# EAGLE design Serial-Basic-CH340C (EAGLE 9.2.1)
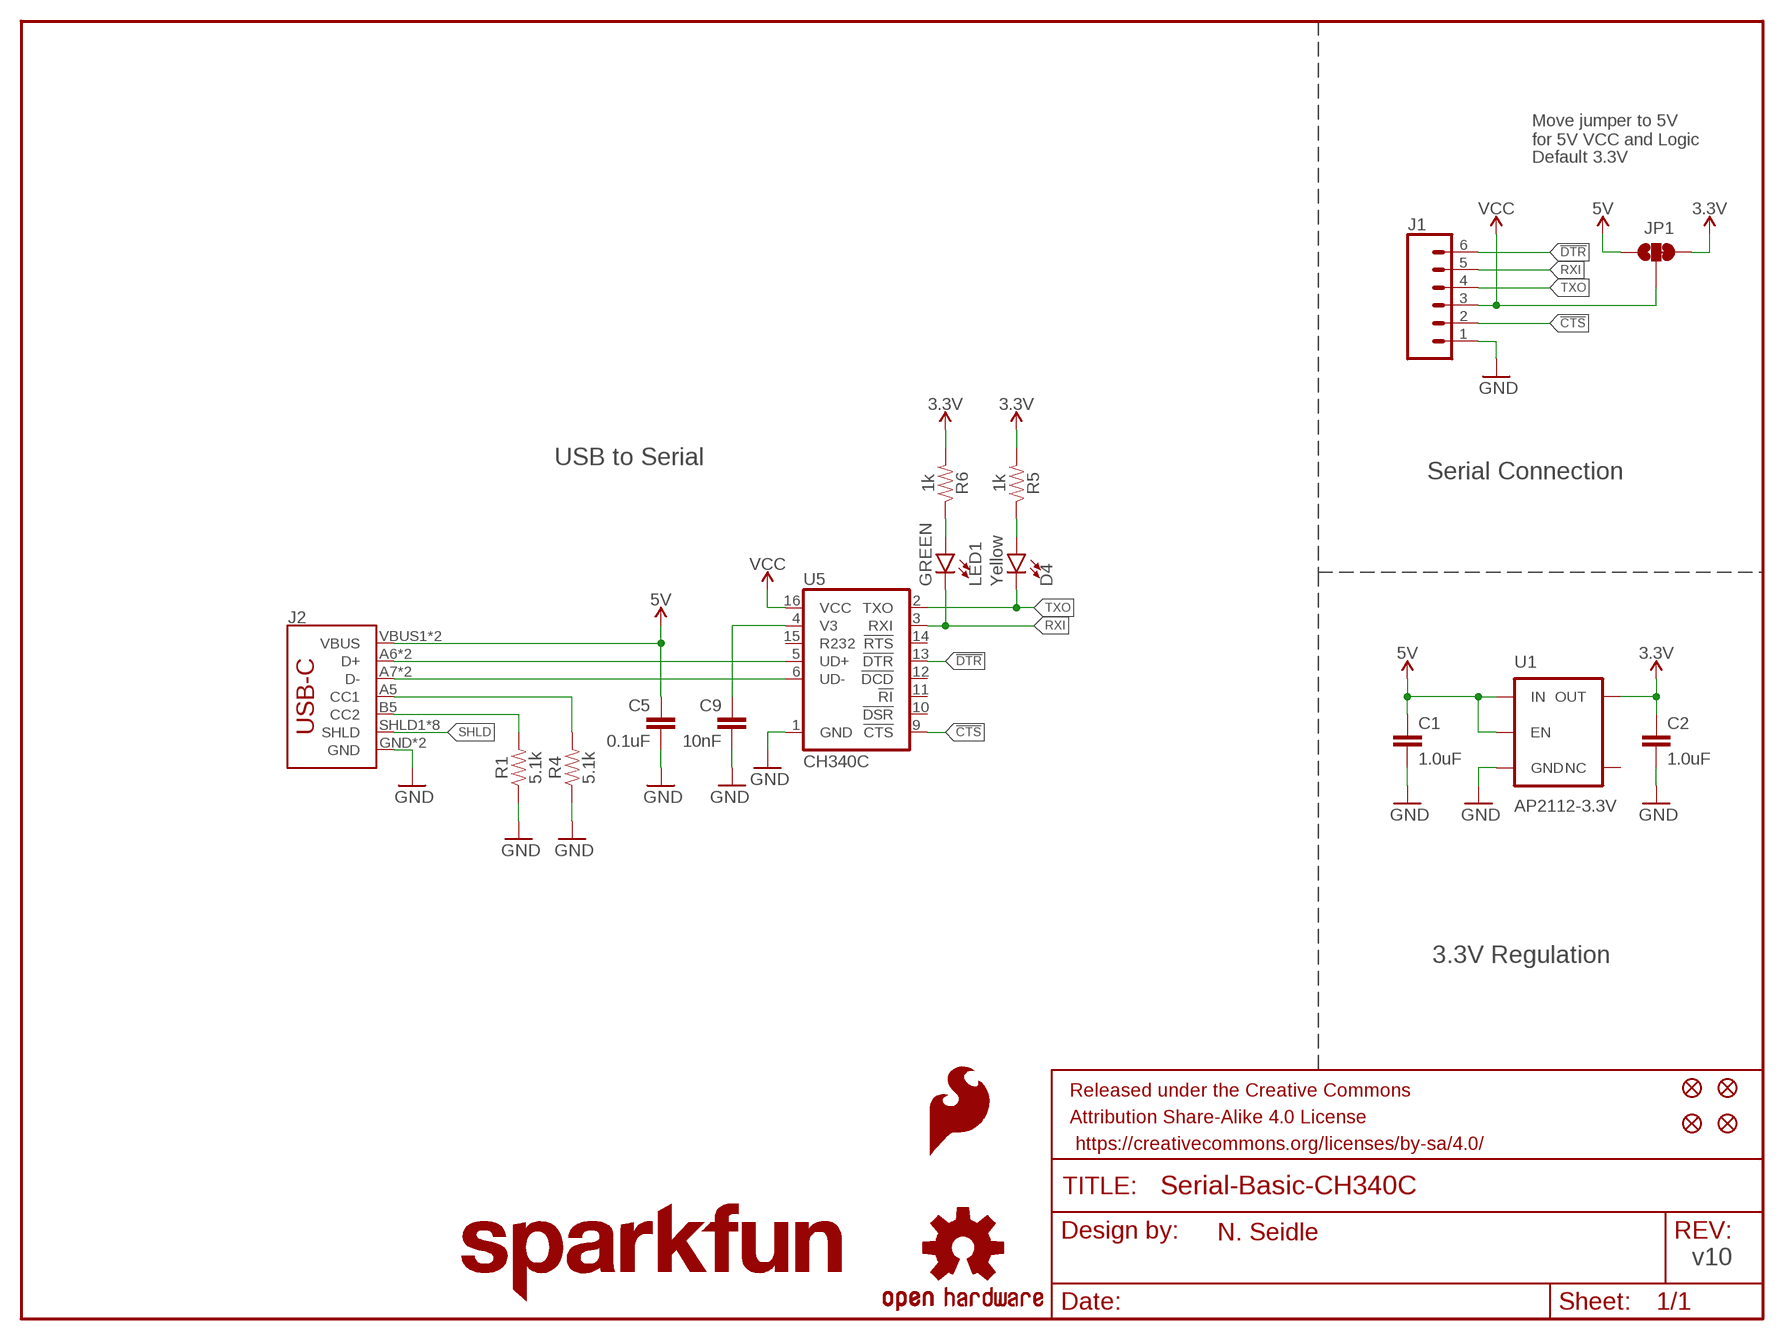
[diagram p0: schematic, sheet 1]

## Parts
C1  1.0uF  1.0UF-0603-16V-10%  [0603]
C2  1.0uF  1.0UF-0603-16V-10%  [0603]
C5  0.1uF  0.1UF-0603-25V-(+80/-20%)  [0603]
C9  10nF  10NF-0603-50V-10%  [0603]
D4  Yellow  LED-YELLOW0603  [LED-0603]
FRAME1  FRAME-LETTER  [CREATIVE_COMMONS]
J1  CONN_06SMD-FEMALE-V2  [1X06-SMD-FEMALE]
J2  USB_C16PIN  [USB-C-16P]
JP1  JUMPER-SMT_3_1-NC_TRACE_SILK  [SMT-JUMPER_3_1-NC_TRACE_SILK]
JP3  FIDUCIAL1X2  [FIDUCIAL-1X2]
JP4  FIDUCIAL1X2  [FIDUCIAL-1X2]
JP5  FIDUCIAL1X2  [FIDUCIAL-1X2]
JP6  FIDUCIAL1X2  [FIDUCIAL-1X2]
LED1  GREEN  LED-GREEN0603  [LED-0603]
LOGO1  OSHW-LOGOS  [OSHW-LOGO-S]
LOGO2  SFE_LOGO_FLAME.1_INCH  [SFE_LOGO_FLAME_.1]
LOGO3  SFE_LOGO_NAME.1_INCH  [SFE_LOGO_NAME_.1]
R1  5.1k  5.1KOHM5.1KOHM-0603-1/10W-1%  [0603]
R4  5.1k  5.1KOHM5.1KOHM-0603-1/10W-1%  [0603]
R5  1k  1KOHM-0603-1/10W-1%  [0603]
R6  1k  1KOHM-0603-1/10W-1%  [0603]
U1  AP2112-3.3V  V_REG_AP2112K-3.3V  [SOT23-5]
U5  CH340C  [SO016]

## Nets
3.3V [power]: C2.1 JP1.3 R5.2 R6.2 U1.5(OUT)
5V: C1.1 C5.1 J2.VBUS1(VBUS) J2.VBUS2(VBUS) JP1.1 U1.1(IN) U1.3(EN)
!CTS: J1.2 U5.9(!CTS)
!DTR: J1.6 U5.13(!DTR)
CC1: J2.A5(CC1) R4.2
CC2: J2.B5(CC2) R1.2
D+: J2.A6(D+) J2.B6(D+) U5.5(UD+)
D-: J2.A7(D-) J2.B7(D-) U5.6(UD-)
GND [power]: C1.2 C2.2 C5.2 C9.2 J1.1 J2.GND J2.GND2(GND) R1.1 R4.1 U1.2(GND) U5.1(GND)
N$1: C9.1 U5.4(V3)
N$10: LED1.A R6.1
N$11: D4.A R5.1
RXI: J1.5 LED1.C U5.3(RXI)
SHLD: J2.SHLD1(SHLD) J2.SHLD2(SHLD) J2.SHLD3(SHLD) J2.SHLD4(SHLD) J2.SHLD5(SHLD) J2.SHLD6(SHLD) J2.SHLD7(SHLD) J2.SHLD8(SHLD)
TXO: D4.C J1.4 U5.2(TXO)
VCC: J1.3 JP1.2 U5.16(VCC)
Unconnected: U1.4(NC) U5.10(!DSR) U5.11(!RI) U5.12(!DCD) U5.14(!RTS) U5.15(R232)

## Notes on the sheet
- Move jumper to 5V
  for 5V VCC and Logic
- Default 3.3V
- USB to Serial
- Serial Connection
- 3.3V Regulation
- N. Seidle
- v10

## Library data of the parts
C1 C2 = SparkFun-Capacitors:1.0UF: 1µF ceramic capacitors A capacitor is a passive two-terminal electrical component used to store electrical energy temporarily in an electric field.; PROD_ID: CAP-00868
C5 = SparkFun-Capacitors:0.1UF: 0.1µF ceramic capacitors A capacitor is a passive two-terminal electrical component used to store electrical energy temporarily in an electric field.; PROD_ID: CAP-00810
C9 = SparkFun-Capacitors:10NF: 0.01uF/10nF/10,000pF ceramic capacitors A capacitor is a passive two-terminal electrical component used to store electrical energy temporarily in an electric field. CAP-09321; PROD_ID: CAP-00867
D4 = SparkFun-LED:LED-YELLOW: Yellow SMD LED Used in manufacturing several products at SparkFun. Packages: 0603 - SMD 0603 package[Product Link] <http://www.kingbrightusa.com/product.asp?catalog_name=LED&product_id=APT1608SYCK> 0603 -SMART - SMART SMD 0603 package (more efficient/more expensive) [Product Link] <http://www.osram-os.com/osram_os/en/products/product-catalog/led-light-emitting-diodes/smartled-0603/ly-l29k/index.jsp> LilyPad - SMD1206 package[Product Datasheet] <https://www.sparkfun.com/datasheets/DevTools/LilyPad/Q150YUS4.pdf> SparkFun Products: Blynk Board <https://www.sparkfun.com/products/13794> IOIO-OTG <https://www.sparkfun.com/products/13613> XBee Explorer Serial <https://www.sparkfun.com/products/13225>; PROD_ID: DIO-09003
FRAME1 = SparkFun-Aesthetics:FRAME-LETTER: Schematic Frame - Letter Standard 8.5x11 US Letter frame
J1 = SparkFun-Connectors:CONN_06: Multi connection point. Often used as Generic Header-pin footprint for 0.1 inch spaced/style header connections On any of the 0.1 inch spaced packages, you can populate with these: Break Away Headers - Straight <https://www.sparkfun.com/products/116> (PRT-00116) Break Away Male Headers - Right Angle <https://www.sparkfun.com/products/553> (PRT-00553) Female Headers <https://www.sparkfun.com/products/115> (PRT-00115) Break Away Headers - Machine Pin <https://www.sparkfun.com/products/117> (PRT-00117) Break Away Female Headers - Swiss Machine Pin <https://www.sparkfun.com/products/743> (PRT-00743) Arduino Stackable Header - 6 Pin <https://www.sparkfun.com/products/9280> (PRT-09280) For SCREWTERMINALS and SPRING TERMINALS visit here: Screw Terimnals on SparkFun.com <https://www.sparkfun.com/search/results?term=Screw+Terminals> (5mm/3.5mm/2.54mm spacing) This device is also useful as a general connection point to wire up your design to another part of your project. Our various solder wires solder well into these plated through hole pads. Hook-Up Wire - Assortment (Stranded, 22 AWG) <https://www.sparkfun.com/products/11375> (PRT-11375) Hook-Up Wire - Assortment (Solid Core, 22 AWG) <https://www.sparkfun.com/products/11367> (PRT-11367) View the entire wire category on our website here <https://www.sparkfun.com/categories/141>; PROD_ID: CONN-09668
J2 = USB-C:USB_C: USB Type C 16Pin Connector
JP1 = SparkFun-Jumpers:JUMPER-SMT_3_1-NC_TRACE: Normally closed trace jumper (1 of 2 connections) This jumper has a trace between two pads so it's normally closed (NC). The other connection is normally open (NO). Use a razor knife to open the connection. For best results follow the IPC guidelines for cutting traces: Cutout at least 0.063 mm (0.005 in). Remove all loose material to clean up the cut area. Seal the cut with an approved epoxy. Reapply solder to reclose the connection, or to close the NO connection.
JP3-JP6 = SparkFun:FIDUCIAL: Fiducial Alignment Points Various fiducial points for machine vision alignment.
LED1 = SparkFun-LED:LED-GREEN: Green SMD LED Used in manufacturing of various products at SparkFun Packages: 0603 - SMD 0603 package [Product Link] <http://www.futureelectronics.com/en/technologies/semiconductors/optoelectronics/leds/Pages/9894312-LTST-C190GKT.aspx?CrossPart=HSMG-C190&IM=0> LilyPad 1206 - SMD1206 LilyPad package [Product Link] <http://www.futureelectronics.com/en/Technologies/Product.aspx?ProductID=IN150NGHARVATEKCORPORATION2049943&IM=0> 1206 - SMD1206 package [Product Link] <http://www.futureelectronics.com/en/technologies/semiconductors/optoelectronics/leds/Pages/8315665-LTST-C150KGKT.aspx?IM=0> 1206 Bottom Mount -SMD 1206 Bottom Mount [Product Link] <http://www.digikey.com/product-detail/en/lite-on-inc/LTST-C230KGKT/160-1456-1-ND/386854> SparkFun Products: Pro Mini 328 -5V <https://www.sparkfun.com/products/821> RedBoard <https://www.sparkfun.com/products/12757> MP3 Trigger <https://www.sparkfun.com/products/13720> Makey Makey <https://www.sparkfun.com/products/11076>; PROD_ID: DIO-00821
LOGO1 = SparkFun-Aesthetics:OSHW-LOGO: Open-Source Hardware (OSHW) Logo This logo indicates the piece of hardware it is found on incorporates a OSHW license and/or adheres to the definition of open source hardware found here: http://freedomdefined.org/OSHW
LOGO2 = SparkFun-Aesthetics:SFE_LOGO_FLAME: SparkFun Flame Logo This is the SparkFun flame logo. The logo on the schematic will always be the same size; the package variant is the height of the flame. Default layer for the logo on the board is tSilk.
LOGO3 = SparkFun-Aesthetics:SFE_LOGO_NAME: SparkFun Font Logo This is the SparkFun name logo. The logo on the schematic will always be the same size; the package variant is the height of the flame part of the logo (or the height the flame would be, if it were drawn). Default layer for the logo on the board is tSilk.
R1 R4 = SparkFun-Resistors:5.1KOHM; PROD_ID: RES-12083
R5 R6 = SparkFun-Resistors:1KOHM: 1kΩ resistor A resistor is a passive two-terminal electrical component that implements electrical resistance as a circuit element. Resistors act to reduce current flow, and, at the same time, act to lower voltage levels within circuits. - Wikipedia; PROD_ID: RES-07856
U1 = SparkFun-PowerIC:V_REG_AP2112: AP2112 - 600mA CMOS LDO Regulator w/ Enable The AP2112 is CMOS process low dropout linear regulator with enable function, the regulator delivers a guaranteed 600mA (min.) continuous load current. Features Output Voltage Accuracy: ±1.5% Output Current: 600mA (Min.) Foldback Short Current Protection: 50mA Enable Function to Turn ON/OFF VOUT Low Dropout Voltage (3.3V): 250mV (Typ.) @IOUT=600mA Excellent Load Regulation: 0.2%/A (Typ.) Excellent Line Regulation: 0.02%/V (Typ.) Low Quiescent Current: 55μA (Typ.) Low Standby Current: 0.01μA (Typ.) Low Output Noise: 50μVRMS PSRR: 100Hz -65dB, 1kHz -65dB OTSD Protection Stable with 1.0μF Flexible Cap: Ceramic, Tantalum and Aluminum Electrolytic Operation Temperature Range: -40°C to 85°C ESD: MM 400V, HBM 4000V; PROD_ID: VREG-12457; VALUE: 3.3V
U5 = SparkFun-IC-Comms:CH340C; PROD_ID: IC-14038

## Net classes
1 power: width 0.178 mm

## Board
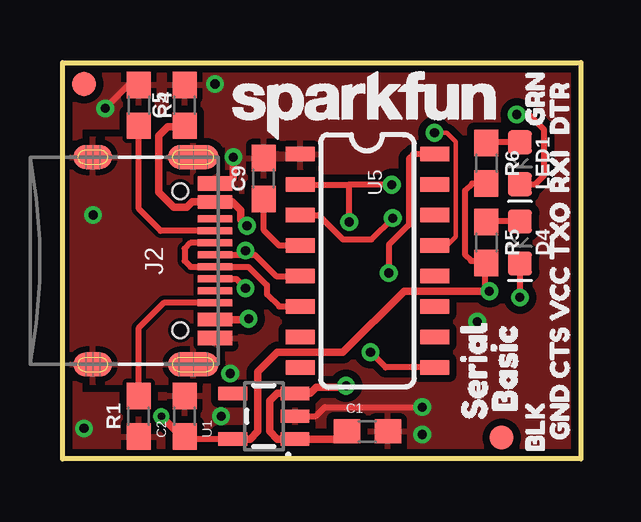
[diagram p1: board, top side]
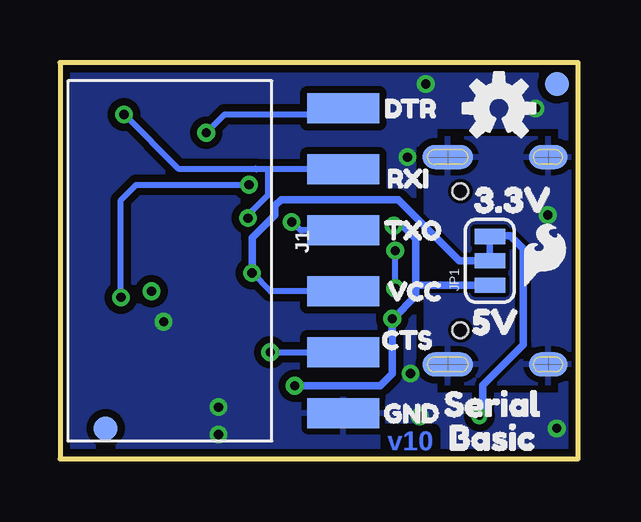
[diagram p2: board, bottom side, seen from below]

Size 21.59 x 16.51 mm. Coordinates in mm from the lower left corner, seen from the top.
Outline: 21.59,0 0,0 0,16.51 21.59,16.51 21.59,0
Copper layers (1*16): Top 0.035mm / dielectric 1.5mm / Bottom 0.035mm
Design rules "SparkFun-2-layer-TIGHT": minimum track width 7mil, minimum drill 15mil, track to track 7mil, track to pad 7mil, pad to pad 7mil, via to via 7mil, smd to smd 7mil, copper to edge 7mil, drill to drill 7mil, minimum pad ring 7mil, minimum via ring 7mil, stop-mask expansion 4mil, vias tented up to drill 25mil, thermal gap 10mil

### Footprints (pad centres in the part's own frame; a part is rotated, then mirrored left to right if it is on the bottom)
0603 = smd 1.1 x 1: 1 -0.85,0; 2 0.85,0
LED-0603 = smd 1 x 1: A -0.877,0; C 0.877,0
1X06-SMD-FEMALE = smd 1.25 x 3: 1 6.35,3.425; 2 3.81,3.425; 3 1.27,3.425; 4 -1.27,3.425; 5 -3.81,3.425; 6 -6.35,3.425
USB-C-16P = smd 0.3 x 1.45: A5 -1.25,0; A6 -0.25,0; A7 0.25,0; A8 1.25,0; B5 1.75,0; B6 0.75,0; B7 -0.75,0; B8 -1.75,0 | smd 0.6 x 1.45: GND -3.225,0; GND2 3.225,0 | smd 1 x 2.1: SHLD1 -4.32,-0.915; SHLD2 4.32,-0.915 | smd 1 x 2.1 bottom: SHLD3 -4.32,-0.915; SHLD4 4.32,-0.915 | smd 1 x 1.6: SHLD5 -4.32,-5.095; SHLD8 4.32,-5.095 | smd 1 x 1.6 bottom: SHLD6 -4.32,-5.095; SHLD7 4.32,-5.095 | smd 0.55 x 1.45: VBUS1 -2.45,0; VBUS2 2.45,0 | hole 0.65: -2.89,-1.445; 2.89,-1.445
SMT-JUMPER_3_1-NC_TRACE_SILK = smd 0.635 x 1.27: 1 -1.016,0; 2 0,0; 3 1.016,0
FIDUCIAL-1X2 = smd 1 x 1: 1 0,0
SOT23-5 = smd 0.55 x 1.2: 1 -0.95,-1.3; 2 0,-1.3; 3 0.95,-1.3; 4 0.95,1.3; 5 -0.95,1.3
SO016 = smd 0.6 x 1.2: 1 -4.445,-2.8; 2 -3.175,-2.8; 3 -1.905,-2.8; 4 -0.635,-2.8; 5 0.635,-2.8; 6 1.905,-2.8; 7 3.175,-2.8; 8 4.445,-2.8; 9 4.445,2.8; 10 3.175,2.8; 11 1.905,2.8; 12 0.635,2.8; 13 -0.635,2.8; 14 -1.905,2.8; 15 -3.175,2.8; 16 -4.445,2.8

### Placement (x,y rotation side)
C1  12.7,1.14 0 top
C2  5.08,1.78 90 top
C5  5.08,14.73 90 top
C9  8.38,11.68 90 top
D4  19.05,9.02 270 top
FRAME1  -8.31,-17.78 0 top  (outside the outline)
J1  13.21,8.26 270 bottom
J2  6.35,8.26 270 top
JP1  3.68,8.26 90 bottom
JP3  0.89,15.62 180 top
JP4  18.29,0.89 180 top
JP5  0.89,15.62 180 bottom
JP6  19.68,1.27 180 bottom
LED1  19.05,12.32 270 top
LOGO1  3.3,14.61 0 bottom
LOGO2  1.4,8.51 0 bottom
LOGO3  12.57,14.73 0 top
R1  3.17,1.78 90 top
R4  3.17,14.73 270 top
R5  17.65,9.02 270 top
R6  17.65,12.32 270 top
U1  8.38,1.78 90 top
U5  12.7,8.26 270 top
U$1  [CTS1]  20.7,2.67 90 top
U$2  [3#3V8]  5.33,10.79 0 bottom
U$3  [5V9]  5.33,5.71 0 bottom
U$4  [SERIAL0]  17.14,0.76 90 top
U$5  [TXO0]  20.7,7.62 90 top
U$6  [VCC2]  20.7,4.95 90 top
U$7  [BASIC1]  18.41,0.89 90 top
U$8  [DTR0]  8.76,14.61 0 bottom
U$9  [SERIAL0]  6.48,2.29 0 bottom
U$10  [RXI1]  8.64,11.68 0 bottom
U$11  [BASIC1]  6.48,0.89 0 bottom
U$12  [TXO0]  8.76,9.53 0 bottom
U$13  [VCC2]  8.76,6.99 0 bottom
U$14  [CTS1]  8.89,4.95 0 bottom
U$15  [GND5]  8.76,1.91 0 bottom
U$17  [BLK6]  19.68,-0.38 90 top
U$18  [DTR0]  20.7,12.83 90 top
U$19  [GND5]  20.7,0.13 90 top
U$20  [GRN7]  19.68,13.21 90 top
U$21  [RXI1]  20.7,10.41 90 top

### Tracks (layer width: path | path; a pad name or v marks a point on that pad's centre or on a via)
3.3V  (via drill 0.3, 0.38)
  Top 0.254: U1.5 5.18,0.83 C2.1 | R6.2 17.06,11.47 16.76,11.18 16.76,8.51 17.02,8.26 17.57,8.26 17.61,8.21 | 17.61,8.21 R5.2 | v17.78,6.99 17.61,7.16 17.61,8.21
  Top 0.305: U1.5 7.81,0.83 8.13,1.14 8.13,3.62 8.95,4.44 11.68,4.44 14.22,6.99 v17.78,6.99 | v4.12,1.78 4.96,0.93 C2.1
  Bottom 0.305: v4.12,1.78 3.97,1.93 3.97,3.08 2.29,4.76 2.29,8.76 2.82,9.3 3.81,9.3 3.79,9.27 JP1.3
5V  (via drill 0.38)
  Top 0.254: 11.54,0.83 C1.1 | v11.81,3.05 11.74,2.98
  Top 0.305: 11.54,0.83 U1.1 8.95,0.83 8.64,1.14 8.64,2.41 8.95,2.73 U1.3 10.32,2.73 10.57,2.98 11.74,2.98 | C5.1 5.12,13.84 4.39,13.84 4,13.46 4,11.12 4.63,10.49 5.18,10.49 5.39,10.71 J2.VBUS1 7.08,10.71 7.43,10.35 7.43,9.97 v7.68,9.72 | J2.VBUS2 7.71,5.8 v7.75,5.84
  Bottom 0.305: 6.76,7.24 6.76,6.79 7.71,5.84 v7.75,5.84 7.75,3.56 8.26,3.05 v11.81,3.05 | 6.76,7.24 6.76,9.18 7.3,9.72 v7.68,9.72 | JP1.1 6.76,7.24
!CTS  (via drill 0.38)
  Top 0.254: U5.9 13.46,3.81 v12.83,4.45
  Bottom 0.254: v12.83,4.45 J1.2
!DTR  (via drill 0.38)
  Top 0.178: U5.13 16,8.89 16.37,9.26 16.37,13.22 16,13.59 v15.49,13.59
  Bottom 0.254: J1.6 10.04,14.35 14.73,14.35 v15.49,13.59
CC1
  Top 0.254: R4.2 3.17,10.41 4.08,9.51 J2.A5
CC2
  Top 0.254: R1.2 3.17,5.46 4.22,6.5 J2.B5
D+  (via drill 0.38)
  Top 0.254: U5.5 8.89,7.62 8.01,8.51 7.62,8.51 | J2.A6 7.62,8.51 | J2.B6 7.23,7.5 v7.62,7.11 | v7.62,8.68 7.62,8.51
  Bottom 0.254: v7.62,7.11 v7.62,8.68
D-
  Top 0.254: U5.6 9.02,6.35 8.51,6.86 8.51,7.24 7.74,8.01 J2.A7 5.34,8.01 5.33,8 5.08,8.26 5.08,8.76 5.32,9.01 J2.B7
GND  (via drill 0.38)
  Top 0.254: R4.1 2.75,15.58 v1.78,14.61 | U1.2 10.54,1.78 10.92,2.16 v14.99,2.16
  Top 0.305: J2.GND 6.91,11.48 7.11,11.68 v7.11,12.57
  other vias: 6.35,15.62 14.99,1.02 6.6,1.78 0.89,1.27 6.99,3.56 17.27,5.71
  pour Top (isolate 0.305, rank 3): 0,16.51 21.59,16.51 21.59,0 0,0
  pour Bottom (isolate 0.305, rank 3): 0,16.51 21.59,16.51 21.59,0 0,0
N$1
  Top 0.254: U5.4 9.02,8.89 8.38,9.53 C9.1
N$10
  Top 0.254: LED1.A 17.68,13.2 R6.1
N$11
  Top 0.254: D4.A 17.68,9.89 R5.1
RXI  (via drill 0.38)
  Top 0.254: U5.3 10.66,10.16 11.68,9.14 12.87,9.14 v13.75,10.03 | LED1.C 19.7,11.44 20.07,11.81 20.07,13.72 19.43,14.35 v18.92,14.35
  Bottom 0.254: v13.75,10.03 13.75,10.18 12.92,11.02 12.92,11.98 12.83,12.06 | v18.92,14.35 16.67,12.1 13.44,12.1 13.41,12.06 12.83,12.06 | J1.5 12.83,12.06
SHLD  (via drill 0.38)
  other vias: 1.27,10.16
  pour Bottom: 0,13.34 6.35,13.34 6.35,3.17 0,3.17
  pour Top: 0,13.34 6.35,13.34 6.35,3.17 0,3.17
TXO  (via drill 0.38)
  Top 0.254: D4.C v19.05,6.73 | v13.72,11.42 11.97,11.42 11.96,11.43 11.94,11.43 | U5.2 11.94,11.43 | v11.94,9.87 11.94,11.43
  Bottom 0.254: v13.72,11.42 18.41,11.42 19.05,10.79 v19.05,6.73 | J1.4 11.56,9.53 11.9,9.87 v11.94,9.87
VCC  (via drill 0.38)
  Top 0.254: U5.16 14.61,12.7 14.43,12.52 14.43,9.75 13.59,8.92 v13.59,7.75
  Bottom 0.254: J1.3 12.83,6.99 v13.59,7.75
  Bottom 0.305: JP1.2 4.95,8.26 7.49,10.79 12.38,10.79 12.64,10.54 12.64,10.16 13.59,9.21 v13.59,7.75

### Text on the board
Bottom: v10
tValues: Close
Measures: All dimensions in inches
tDocu: N. Seidle